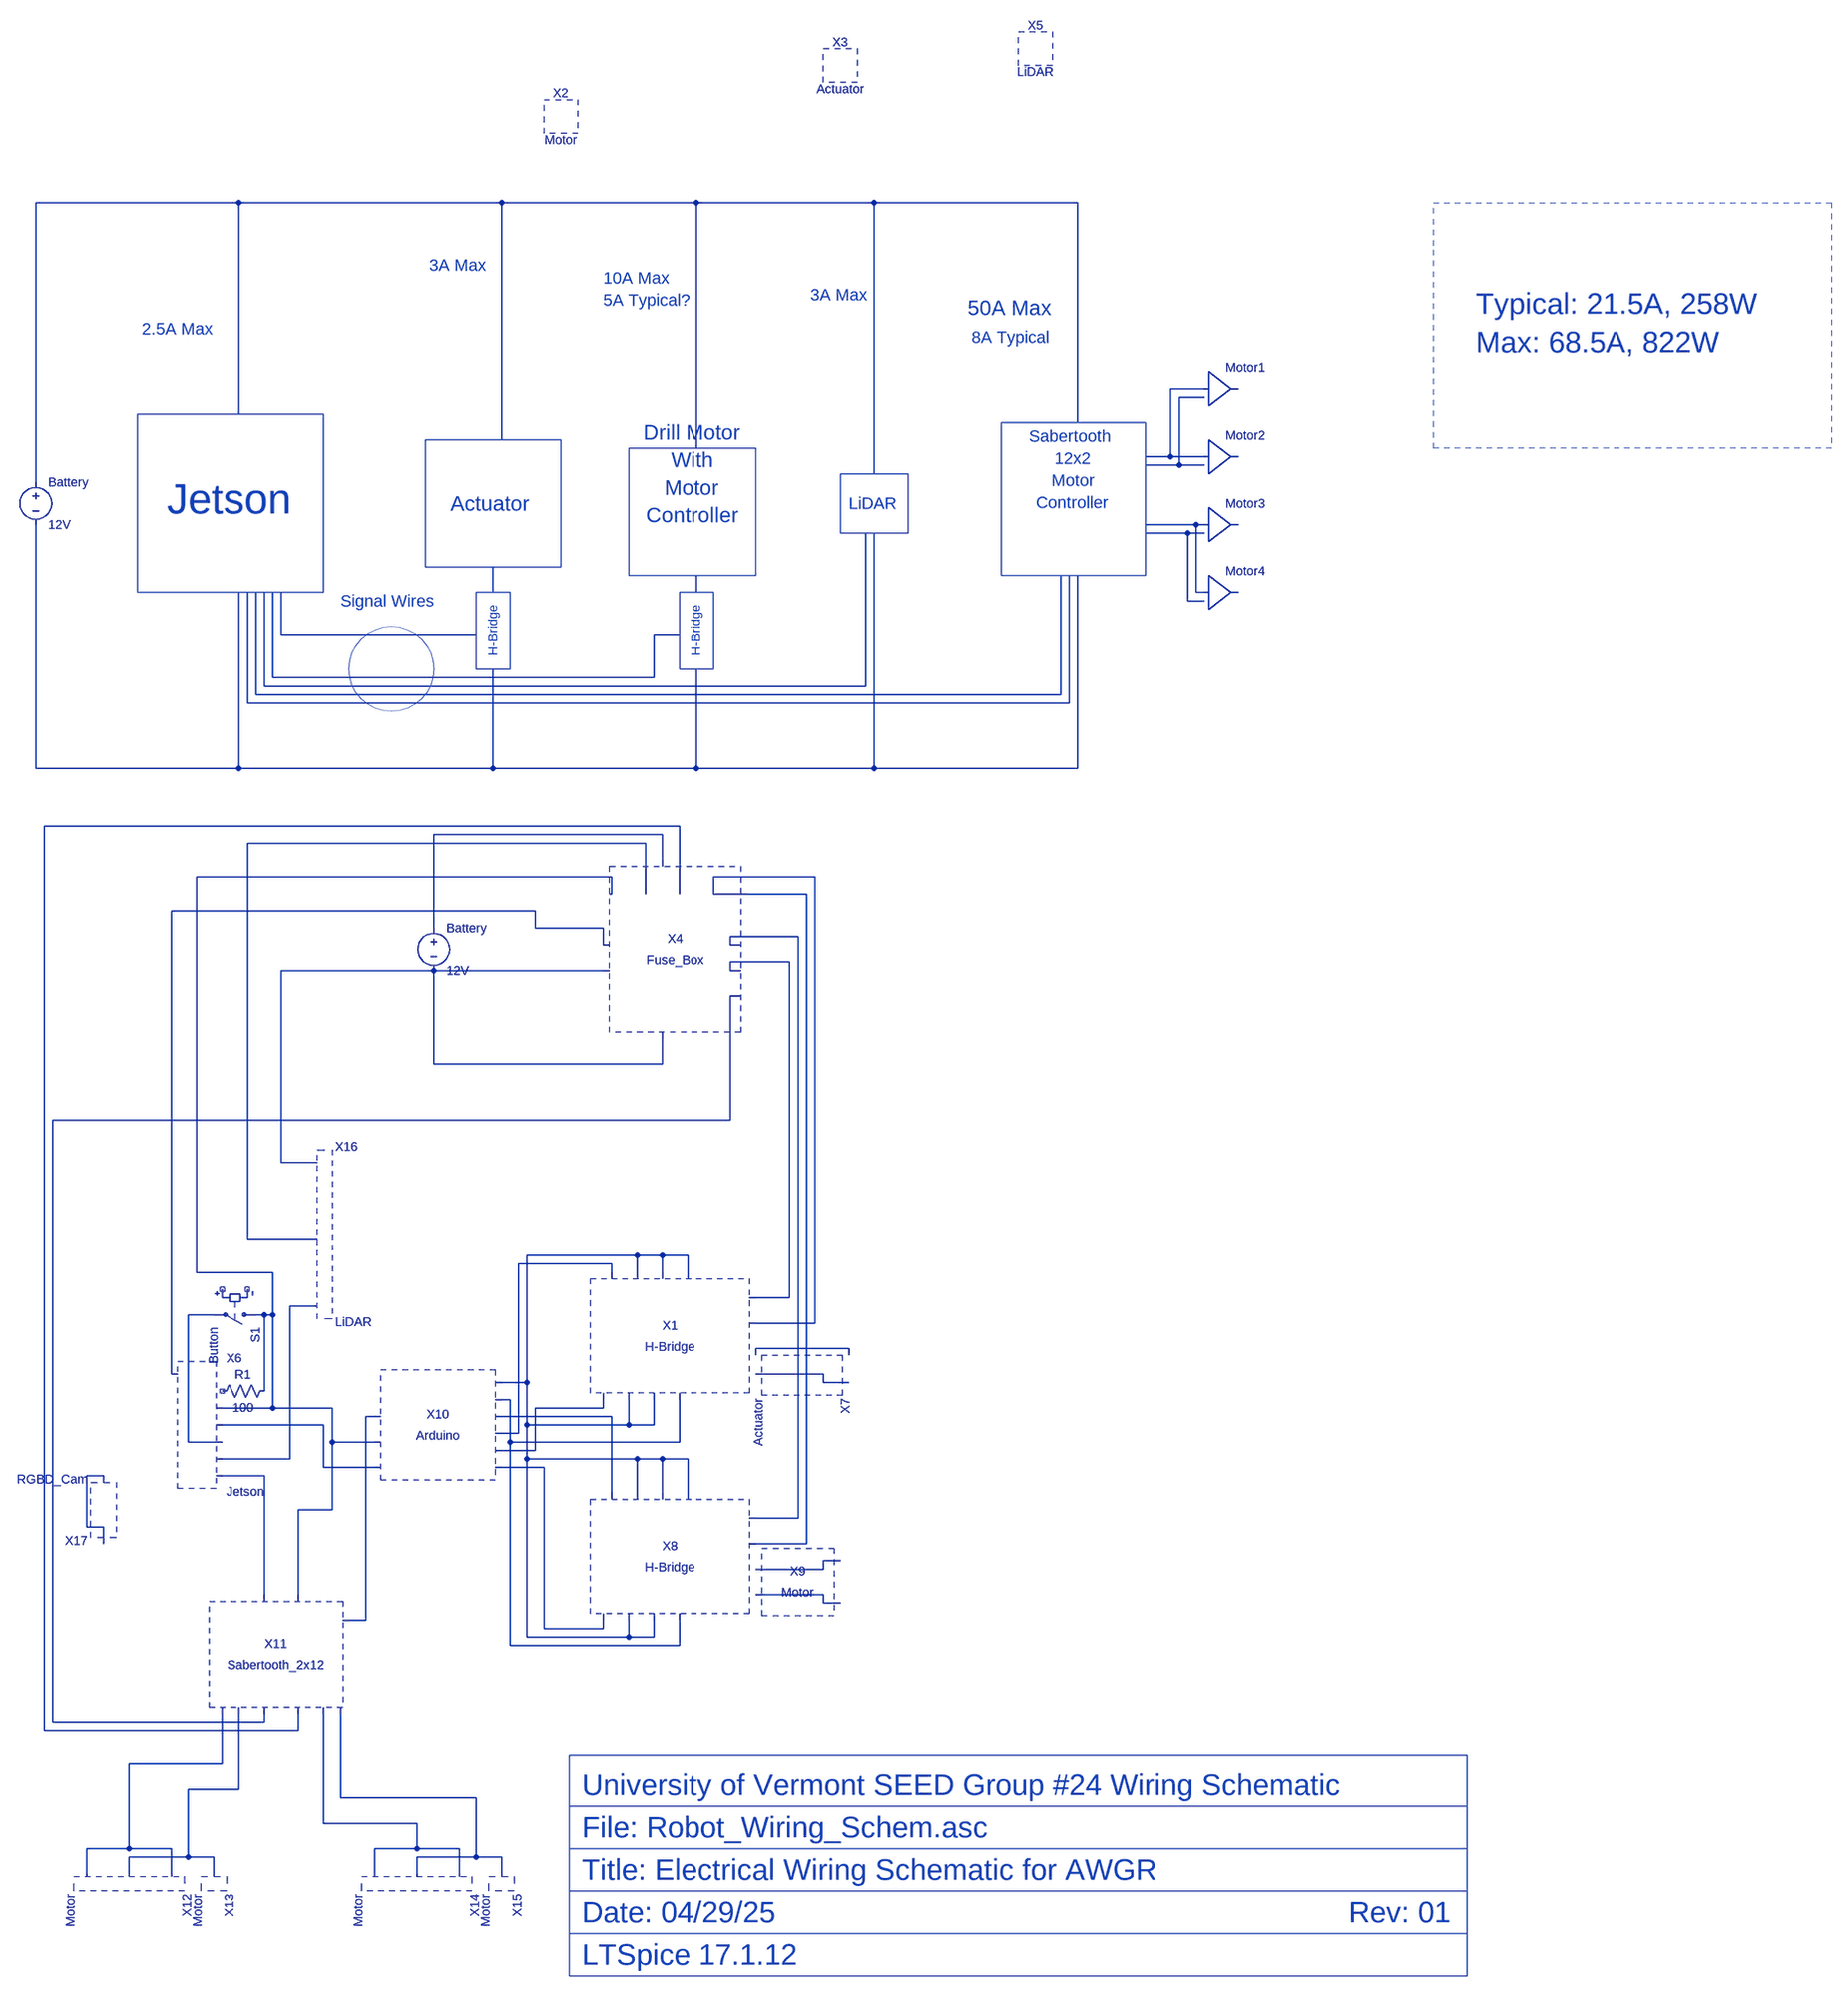
[diagram p0: schematic Robot_Wiring_Schem.asc]
Robot_Wiring_Schem.asc, the LTspice schematic file:
Version 4
SHEET 1 1252 4900
WIRE -1760 -80 -2144 -80
WIRE -1264 -80 -1760 -80
WIRE -896 -80 -1264 -80
WIRE -560 -80 -896 -80
WIRE -176 -80 -560 -80
WIRE 64 272 0 272
WIRE 64 288 16 288
WIRE -1760 320 -1760 -80
WIRE -176 336 -176 -80
WIRE -1264 368 -1264 -80
WIRE -896 384 -896 -80
WIRE 0 400 0 272
WIRE 0 400 -48 400
WIRE 64 400 0 400
WIRE 16 416 16 288
WIRE 16 416 -48 416
WIRE 64 416 16 416
WIRE -560 432 -560 -80
WIRE -2144 448 -2144 -80
WIRE 48 528 -48 528
WIRE 64 528 48 528
WIRE 32 544 -48 544
WIRE 64 544 32 544
WIRE -1280 656 -1280 608
WIRE -896 656 -896 624
WIRE 48 656 48 528
WIRE 64 656 48 656
WIRE 32 672 32 544
WIRE 64 672 32 672
WIRE -1680 736 -1680 656
WIRE -1312 736 -1680 736
WIRE -928 736 -976 736
WIRE -1696 816 -1696 656
WIRE -976 816 -976 736
WIRE -976 816 -1696 816
WIRE -1712 832 -1712 656
WIRE -576 832 -576 544
WIRE -576 832 -1712 832
WIRE -1728 848 -1728 656
WIRE -208 848 -208 624
WIRE -208 848 -1728 848
WIRE -1744 864 -1744 656
WIRE -192 864 -192 624
WIRE -192 864 -1744 864
WIRE -2144 1264 -2144 528
WIRE -1760 1264 -1760 656
WIRE -1760 1264 -2144 1264
WIRE -1280 1264 -1280 800
WIRE -1280 1264 -1760 1264
WIRE -896 1264 -896 800
WIRE -896 1264 -1280 1264
WIRE -560 1264 -560 544
WIRE -560 1264 -896 1264
WIRE -176 1264 -176 624
WIRE -176 1264 -560 1264
WIRE -928 2400 -2128 2400
WIRE -960 2416 -1392 2416
WIRE -992 2432 -1744 2432
WIRE -960 2464 -960 2416
WIRE -1056 2496 -1840 2496
WIRE -672 2496 -864 2496
WIRE -1056 2528 -1056 2496
WIRE -992 2528 -992 2432
WIRE -928 2528 -928 2400
WIRE -864 2528 -864 2496
WIRE -688 2528 -800 2528
WIRE -1200 2560 -1888 2560
WIRE -1392 2592 -1392 2416
WIRE -1200 2592 -1200 2560
WIRE -1072 2592 -1200 2592
WIRE -704 2608 -832 2608
WIRE -1072 2624 -1072 2592
WIRE -832 2624 -832 2608
WIRE -720 2656 -832 2656
WIRE -1392 2672 -1680 2672
WIRE -1072 2672 -1392 2672
WIRE -832 2672 -832 2656
WIRE -1392 2848 -1392 2672
WIRE -960 2848 -960 2800
WIRE -960 2848 -1392 2848
WIRE -832 3104 -832 2720
WIRE -832 3104 -2112 3104
WIRE -1680 3184 -1680 2672
WIRE -1616 3184 -1680 3184
WIRE -1744 3328 -1744 2432
WIRE -1616 3328 -1744 3328
WIRE -1008 3360 -1216 3360
WIRE -960 3360 -1008 3360
WIRE -912 3360 -960 3360
WIRE -1056 3376 -1232 3376
WIRE -1840 3392 -1840 2496
WIRE -1696 3392 -1840 3392
WIRE -1056 3392 -1056 3376
WIRE -1008 3392 -1008 3360
WIRE -960 3392 -960 3360
WIRE -912 3392 -912 3360
WIRE -720 3440 -720 2656
WIRE -720 3440 -784 3440
WIRE -1616 3456 -1664 3456
WIRE -1808 3472 -1856 3472
WIRE -1712 3472 -1728 3472
WIRE -1696 3472 -1696 3392
WIRE -1696 3472 -1712 3472
WIRE -672 3488 -672 2496
WIRE -672 3488 -784 3488
WIRE -608 3536 -784 3536
WIRE -1888 3584 -1888 2560
WIRE -656 3584 -784 3584
WIRE -1216 3600 -1216 3360
WIRE -1216 3600 -1264 3600
WIRE -656 3600 -656 3584
WIRE -608 3600 -656 3600
WIRE -1712 3616 -1712 3472
WIRE -1248 3632 -1264 3632
WIRE -1696 3648 -1696 3472
WIRE -1696 3648 -1792 3648
WIRE -1584 3648 -1696 3648
WIRE -1072 3648 -1072 3632
WIRE -1072 3648 -1200 3648
WIRE -1504 3664 -1520 3664
WIRE -1056 3664 -1264 3664
WIRE -1600 3680 -1792 3680
WIRE -1216 3680 -1216 3600
WIRE -1024 3680 -1024 3632
WIRE -1024 3680 -1216 3680
WIRE -976 3680 -976 3632
WIRE -976 3680 -1024 3680
WIRE -1232 3696 -1232 3376
WIRE -1232 3696 -1264 3696
WIRE -1856 3712 -1856 3472
WIRE -1792 3712 -1856 3712
WIRE -1584 3712 -1584 3648
WIRE -1504 3712 -1584 3712
WIRE -1248 3712 -1248 3632
WIRE -928 3712 -928 3632
WIRE -928 3712 -1248 3712
WIRE -1200 3728 -1200 3648
WIRE -1200 3728 -1264 3728
WIRE -1664 3744 -1664 3456
WIRE -1664 3744 -1792 3744
WIRE -1216 3744 -1216 3680
WIRE -1008 3744 -1216 3744
WIRE -960 3744 -1008 3744
WIRE -912 3744 -960 3744
WIRE -1600 3760 -1600 3680
WIRE -1504 3760 -1600 3760
WIRE -1184 3760 -1264 3760
WIRE -2016 3776 -2048 3776
WIRE -1712 3776 -1792 3776
WIRE -1056 3808 -1056 3664
WIRE -1008 3808 -1008 3744
WIRE -960 3808 -960 3744
WIRE -912 3808 -912 3744
WIRE -1584 3840 -1584 3712
WIRE -1584 3840 -1648 3840
WIRE -704 3856 -704 2608
WIRE -704 3856 -784 3856
WIRE -2048 3872 -2048 3776
WIRE -2016 3872 -2048 3872
WIRE -2016 3904 -2016 3872
WIRE -688 3904 -688 2528
WIRE -688 3904 -784 3904
WIRE -624 3936 -656 3936
WIRE -656 3952 -656 3936
WIRE -656 3952 -784 3952
WIRE -1712 4000 -1712 3776
WIRE -1648 4000 -1648 3840
WIRE -656 4000 -784 4000
WIRE -656 4016 -656 4000
WIRE -624 4016 -656 4016
WIRE -1520 4048 -1520 3664
WIRE -1520 4048 -1552 4048
WIRE -1184 4064 -1184 3760
WIRE -1072 4064 -1072 4048
WIRE -1072 4064 -1184 4064
WIRE -1216 4080 -1216 3744
WIRE -1024 4080 -1024 4048
WIRE -1024 4080 -1216 4080
WIRE -976 4080 -976 4048
WIRE -976 4080 -1024 4080
WIRE -1248 4096 -1248 3712
WIRE -928 4096 -928 4048
WIRE -928 4096 -1248 4096
WIRE -2112 4240 -2112 3104
WIRE -1712 4240 -1712 4224
WIRE -1712 4240 -2112 4240
WIRE -2128 4256 -2128 2400
WIRE -1648 4256 -1648 4224
WIRE -1648 4256 -2128 4256
WIRE -1792 4320 -1792 4224
WIRE -1792 4320 -1968 4320
WIRE -1760 4368 -1760 4224
WIRE -1760 4368 -1856 4368
WIRE -1568 4384 -1568 4224
WIRE -1312 4384 -1568 4384
WIRE -1600 4432 -1600 4224
WIRE -1424 4432 -1600 4432
WIRE -1968 4480 -1968 4320
WIRE -1968 4480 -2048 4480
WIRE -1888 4480 -1968 4480
WIRE -1424 4480 -1424 4432
WIRE -1424 4480 -1504 4480
WIRE -1344 4480 -1424 4480
WIRE -1856 4496 -1856 4368
WIRE -1856 4496 -1968 4496
WIRE -1808 4496 -1856 4496
WIRE -1312 4496 -1312 4384
WIRE -1312 4496 -1424 4496
WIRE -1264 4496 -1312 4496
WIRE -2048 4528 -2048 4480
WIRE -1968 4528 -1968 4496
WIRE -1888 4528 -1888 4480
WIRE -1808 4528 -1808 4496
WIRE -1504 4528 -1504 4480
WIRE -1424 4528 -1424 4496
WIRE -1344 4528 -1344 4480
WIRE -1264 4528 -1264 4496
SYMBOL voltage -2144 432 R0
SYMATTR InstName Battery
SYMATTR Value 12V
SYMBOL Digital\\buf1 64 208 R0
SYMATTR InstName Motor1
SYMBOL Digital\\buf1 64 336 R0
SYMATTR InstName Motor2
SYMBOL Digital\\buf1 64 464 R0
SYMATTR InstName Motor3
SYMBOL Digital\\buf1 64 592 R0
SYMATTR InstName Motor4
SYMBOL H-Bridge -1056 3456 R0
SYMATTR InstName X1
SYMBOL Motor -1152 -416 R0
SYMATTR InstName X2
SYMBOL Actuator -624 -512 R0
SYMATTR InstName X3
SYMBOL Fuse_Box -960 2624 R0
SYMATTR InstName X4
SYMBOL voltage -1392 2576 R0
SYMATTR InstName Battery
SYMATTR Value 12V
SYMBOL LiDAR -256 -544 R0
SYMATTR InstName X5
SYMBOL Jetson -1904 3696 R0
SYMATTR InstName X6
SYMBOL Actuator -496 3568 R90
SYMATTR InstName X7
SYMBOL H-Bridge -1056 3872 R0
SYMATTR InstName X8
SYMBOL Motor -512 3936 R0
SYMATTR InstName X9
SYMBOL Arduino -1392 3728 R0
SYMATTR InstName X10
SYMBOL Sabertooth_2x12 -1680 4112 R0
SYMATTR InstName X11
SYMBOL Motor -1968 4640 R90
SYMATTR InstName X12
SYMBOL Motor -1808 4640 R90
SYMATTR InstName X13
SYMBOL Motor -1424 4640 R90
SYMATTR InstName X14
SYMBOL Motor -1264 4640 R90
SYMATTR InstName X15
SYMBOL LiDAR -1504 3248 R0
SYMATTR InstName X16
SYMBOL RGBD_Cam -2016 3936 R180
SYMATTR InstName X17
SYMBOL sw -1712 3472 R90
SYMATTR InstName S1
SYMATTR Value Button
SYMBOL res -1696 3600 R90
WINDOW 0 0 56 VBottom 2
WINDOW 3 32 56 VTop 2
SYMATTR InstName R1
SYMATTR Value 100
TEXT -184 424 Center 3 ;Sabertooth \n12x2\nMotor\nController
TEXT -608 488 Left 3 ;LiDAR
TEXT -1896 480 Left 6 ;Jetson
TEXT -1360 488 Left 4 ;Actuator
TEXT -904 432 Center 4 ;Drill Motor\nWith\nMotor\nController
TEXT -1944 160 Left 3 ;2.5A Max
TEXT -1400 40 Left 3 ;3A Max
TEXT -680 96 Left 3 ;3A Max
TEXT -384 120 Left 4 ;50A Max
TEXT -376 176 Left 3 ;8A Typical
TEXT -1072 64 Left 3 ;10A Max\n5A Typical?
TEXT 576 112 Left 5 ;Typical: 21.5A, 258W\nMax: 68.5A, 822W
TEXT -1280 680 VRight 2 ;H-Bridge
TEXT -896 680 VRight 2 ;H-Bridge
TEXT -1568 672 Left 3 ;Signal Wires
TEXT -1112 4360 Left 5 ;University of Vermont SEED Group #24 Wiring Schematic
TEXT -1112 4440 Left 5 ;File: Robot_Wiring_Schem.asc
TEXT -1112 4520 Left 5 ;Title: Electrical Wiring Schematic for AWGR
TEXT -1112 4600 Left 5 ;Date: 04/29/25
TEXT 336 4600 Left 5 ;Rev: 01
TEXT -1112 4680 Left 5 ;LTSpice 17.1.12
RECTANGLE Normal -48 624 -320 336
RECTANGLE Normal -496 544 -624 432
RECTANGLE Normal -1600 656 -1952 320
RECTANGLE Normal -1152 608 -1408 368
RECTANGLE Normal -784 624 -1024 384
RECTANGLE Normal 1248 384 496 -80 1
RECTANGLE Normal -1248 800 -1312 656
RECTANGLE Normal -864 800 -928 656
RECTANGLE Normal 560 4720 -1136 4304
RECTANGLE Normal 560 4400 -1136 4400
RECTANGLE Normal 560 4480 -1136 4480
RECTANGLE Normal 560 4560 -1136 4560
RECTANGLE Normal 560 4640 -1136 4640
CIRCLE Normal -1392 880 -1552 720 1

The netlist it stands for:
* Robot_Wiring_Schem.asc
V§Battery N001 N013 12V
A§Motor1 N002 N003 N003 N003 N003 N003 N003 N003 BUF
A§Motor2 N002 N003 N003 N003 N003 N003 N003 N003 BUF
A§Motor3 N004 N005 N005 N005 N005 N005 N005 N005 BUF
A§Motor4 N004 N005 N005 N005 N005 N005 N005 N005 BUF
* X1: H-Bridge (symbol H-Bridge not available, pin order unknown); nets seen at it: N018, N022, N025, N026, N031, N032
* X2: Motor (symbol Motor not available, pin order unknown); nets seen at it: 
* X3: Actuator (symbol Actuator not available, pin order unknown); nets seen at it: 
* X4: Fuse_Box (symbol Fuse_Box not available, pin order unknown); nets seen at it: N014, N015, N016, N017, N018, N019, N020, N021, N022, N023, N024
V§Battery N015 N023 12V
* X5: LiDAR (symbol LiDAR not available, pin order unknown); nets seen at it: 
* X6: Jetson (symbol Jetson not available, pin order unknown); nets seen at it: N017, N020, N027, N028, N035, N038
* X7: Actuator (symbol Actuator not available, pin order unknown); nets seen at it: N029, N030
* X8: H-Bridge (symbol H-Bridge not available, pin order unknown); nets seen at it: N019, N021, N025, N031, N034, N036
* X9: Motor (symbol Motor not available, pin order unknown); nets seen at it: N039, N040
* X10: Arduino (symbol Arduino not available, pin order unknown); nets seen at it: N017, N025, N026, N031, N032, N033, N034, N035, N036
* X11: Sabertooth_2x12 (symbol Sabertooth_2x12 not available, pin order unknown); nets seen at it: N014, N017, N024, N033, N038, N041, N042, N043, N044
* X12: Motor (symbol Motor not available, pin order unknown); nets seen at it: N041, N042
* X13: Motor (symbol Motor not available, pin order unknown); nets seen at it: N042
* X14: Motor (symbol Motor not available, pin order unknown); nets seen at it: N043, N044
* X15: Motor (symbol Motor not available, pin order unknown); nets seen at it: N043
* X16: LiDAR (symbol LiDAR not available, pin order unknown); nets seen at it: N016, N023, N027
* X17: RGBD_Cam (symbol RGBD_Cam not available, pin order unknown); nets seen at it: N037
S1 N017 N028 NC_01 NC_02 Button
R1 N017 NC_03 100
* Sabertooth
* 12x2
* Motor
* Controller
* LiDAR
* Jetson
* Actuator
* Drill Motor
* With
* Motor
* Controller
* 2.5A Max
* 3A Max
* 3A Max
* 50A Max
* 8A Typical
* 10A Max
* 5A Typical?
* Typical: 21.5A, 258W
* Max: 68.5A, 822W
* H-Bridge
* H-Bridge
* Signal Wires
* University of Vermont SEED Group #24 Wiring Schematic
* File: Robot_Wiring_Schem.asc
* Title: Electrical Wiring Schematic for AWGR
* Date: 04/29/25
* Rev: 01
* LTSpice 17.1.12
.backanno
.end